# Altium project Quadcopter_controller.PrjPcb
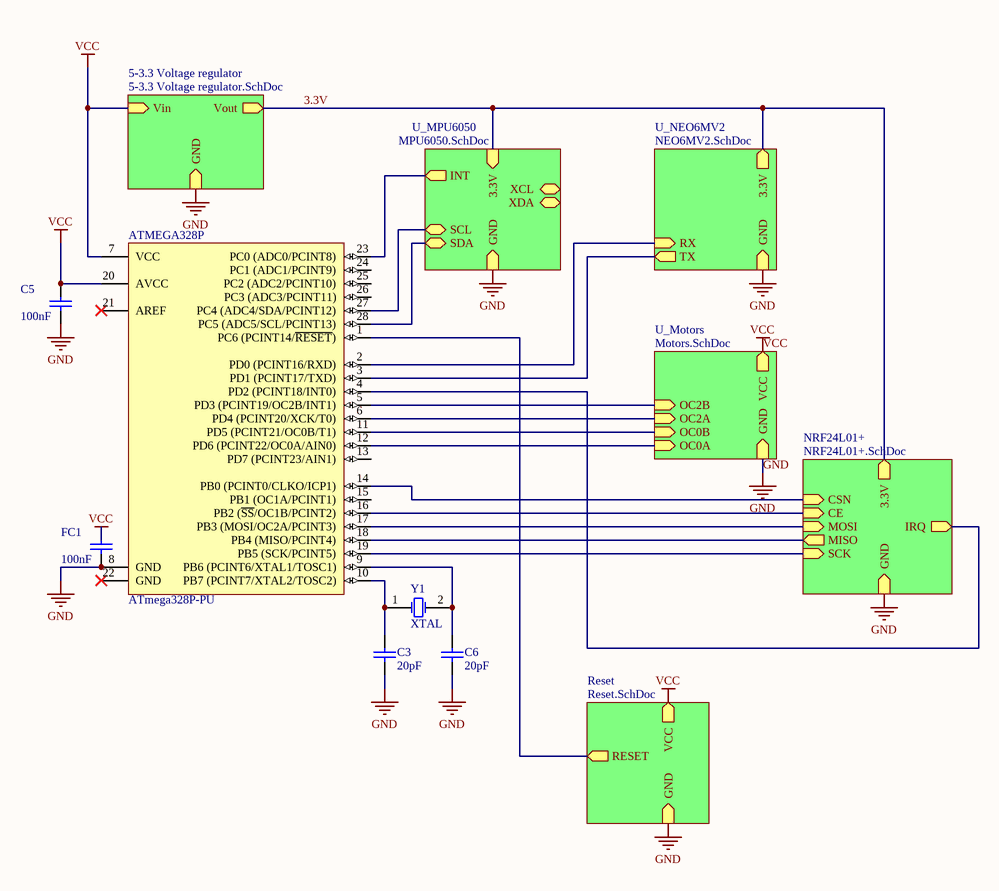
[diagram p0: Quadcopter_controller.SchDoc]
7 sheets, 24 parts. Net scope: hierarchical (ports join the sheet entries above them; power ports are global).
Board file: Quadcopter_controller.PcbDoc
Sheets:
  Quadcopter_controller.SchDoc
    5-3.3 Voltage regulator = 5-3.3 Voltage regulator.SchDoc
    NRF24L01+ = NRF24L01+.SchDoc
    U_Motors = Motors.SchDoc
    U_NEO6MV2 = NEO6MV2.SchDoc
    Reset = Reset.SchDoc
    U_MPU6050 = MPU6050.SchDoc

## Sheet Quadcopter_controller.SchDoc
size A4

### Parts
ATMEGA328P  ATmega328P-PU  [28P3]
C3  20pF  [RAD-0.3]
C5  100nF  [RAD-0.3]
C6  20pF  [RAD-0.3]
FC1  100nF  [RAD-0.3]
Y1  XTAL  [R38]

### Sub-sheets
5-3.3 Voltage regulator = 5-3.3 Voltage regulator.SchDoc: Vin, Vout, GND
NRF24L01+ = NRF24L01+.SchDoc: MOSI (in), SCK (in), 3.3V, CSN (in), CE (in), IRQ (out), MISO (out), GND
Reset = Reset.SchDoc: RESET (out), VCC, GND
U_Motors = Motors.SchDoc: OC0A (in), OC0B (in), OC2A (in), OC2B (in), GND, VCC
U_MPU6050 = MPU6050.SchDoc: 3.3V (in), GND (in), SCL (bidir), SDA (bidir), XDA (bidir), XCL (bidir), INT (out)
U_NEO6MV2 = NEO6MV2.SchDoc: GND, 3.3V, RX (in), TX (out)

### Nets
GND: ATMEGA328P.8(GND) C3.1 C5.1 C6.1 FC1.1 ; sheet 5-3.3 Voltage regulator/GND, sheet NRF24L01+/GND, sheet U_Motors/GND, sheet U_NEO6MV2/GND, sheet Reset/GND, sheet U_MPU6050/GND
VCC: ATMEGA328P.7(VCC) ATMEGA328P.20(AVCC) C5.2 FC1.2 ; sheet 5-3.3 Voltage regulator/Vin, sheet U_Motors/VCC, sheet Reset/VCC
3.3V: sheet 5-3.3 Voltage regulator/Vout, sheet NRF24L01+/3.3V, sheet U_NEO6MV2/3.3V, sheet U_MPU6050/3.3V
NetATMEGA328P_1: ATMEGA328P.1(PC6_(PCINT14/~{RESET})) ; sheet Reset/RESET
NetATMEGA328P_2: ATMEGA328P.2(PD0_(PCINT16/RXD)) ; sheet U_NEO6MV2/RX
NetATMEGA328P_3: ATMEGA328P.3(PD1_(PCINT17/TXD)) ; sheet U_NEO6MV2/TX
NetATMEGA328P_4: ATMEGA328P.4(PD2_(PCINT18/INT0)) ; sheet NRF24L01+/IRQ
NetATMEGA328P_5: ATMEGA328P.5(PD3_(PCINT19/OC2B/INT1)) ; sheet U_Motors/OC2B
NetATMEGA328P_6: ATMEGA328P.6(PD4_(PCINT20/XCK/T0)) ; sheet U_Motors/OC2A
NetATMEGA328P_9: ATMEGA328P.9(PB6_(PCINT6/XTAL1/TOSC1)) C6.2 Y1.2(OSC2)
NetATMEGA328P_10: ATMEGA328P.10(PB7_(PCINT7/XTAL2/TOSC2)) C3.2 Y1.1(OSC1)
NetATMEGA328P_11: ATMEGA328P.11(PD5_(PCINT21/OC0B/T1)) ; sheet U_Motors/OC0B
NetATMEGA328P_12: ATMEGA328P.12(PD6_(PCINT22/OC0A/AIN0)) ; sheet U_Motors/OC0A
NetATMEGA328P_14: ATMEGA328P.14(PB0_(PCINT0/CLKO/ICP1)) ; sheet NRF24L01+/CSN
NetATMEGA328P_16: ATMEGA328P.16(PB2_(~{SS}/OC1B/PCINT2)) ; sheet NRF24L01+/CE
NetATMEGA328P_17: ATMEGA328P.17(PB3_(MOSI/OC2A/PCINT3)) ; sheet NRF24L01+/MOSI
NetATMEGA328P_18: ATMEGA328P.18(PB4_(MISO/PCINT4)) ; sheet NRF24L01+/MISO
NetATMEGA328P_19: ATMEGA328P.19(PB5_(SCK/PCINT5)) ; sheet NRF24L01+/SCK
NetATMEGA328P_23: ATMEGA328P.23(PC0_(ADC0/PCINT8)) ; sheet U_MPU6050/INT
NetATMEGA328P_27: ATMEGA328P.27(PC4_(ADC4/SDA/PCINT12)) ; sheet U_MPU6050/SCL
NetATMEGA328P_28: ATMEGA328P.28(PC5_(ADC5/SCL/PCINT13)) ; sheet U_MPU6050/SDA

Not connected (* = marked no-connect by the designer): ATMEGA328P 13(PD7_(PCINT23/AIN1)) 15(PB1_(OC1A/PCINT1)) 21(AREF)* 22(GND)* 24(PC1_(ADC1/PCINT9)) 25(PC2_(ADC2/PCINT10)) 26(PC3_(ADC3/PCINT11))

### Library data of the parts
ATMEGA328P = ATmega328P-PU: 8-bit AVR Microcontroller, 32KB Flash, 1KB EEPROM, 2KB SRAM, 28-pin PDIP, Industrial Grade (-40°C to 85°C); DatasheetVersion: revD, May-2011; PackageVersion: revB, Sep-2001; PackageReference: 28P3; PackageDescription: 28-lead (0.300"/7.62mm Wide) Plastic Dual Inline Package (PDIP); ComponentLink1Description: Manufacturer URL; ComponentLink1URL: http://www.atmel.com/; ComponentLink2Description: ATmega48A/48PA/88A/88PA/168A/168PA/328/328P Datasheet; ComponentLink2URL: http://www.atmel.com/dyn/resources/prod_documents/8271.pdf; ComponentLink3Description: ATmega48A/48PA/88A/88PA/168A/168PA/328/328P Summary; ComponentLink3URL: http://www.atmel.com/dyn/resources/prod_documents/8271S.pdf
C3 C5 C6 FC1 = Cap: Capacitor; Published: 8-Jun-2000; LatestRevisionDate: 17-Jul-2002; LatestRevisionNote: Re-released for DXP Platform.; PackageReference: RAD-0.3; Publisher: Altium Limited; PackageDescription: Radial Cap, Thru-Hole; 2 Leads; 0.3 in Pin Spacing
  C3 C6: Value: 20pF
  C5 FC1: Value: 100nF
Y1 = XTAL: Crystal Oscillator; Published: 8-Jun-2000; LatestRevisionDate: 17-Jul-2002; LatestRevisionNote: Re-released for DXP Platform.; PackageReference: R38; Publisher: Altium Limited; PackageDescription: Crystal, Thru-Hole; 2 Leads; Body 3.1 x 8.2 mm (Dia.xH)

## Sheet 5-3.3 Voltage regulator.SchDoc
size A4
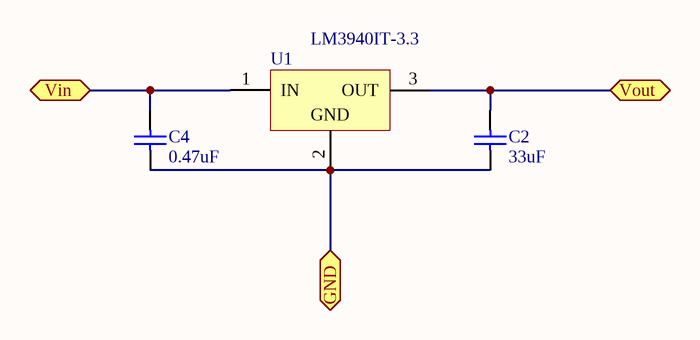
[diagram p1: 5-3.3 Voltage regulator.SchDoc]

### Parts
C2  33uF  [RAD-0.3]
C4  0.47uF  [RAD-0.3]
U1  LM3940IT-3.3  [T03B]

### Ports
GND, Vin, Vout

### Nets
GND: C2.1 C4.1 U1.2(GND) ; port GND
VCC: C4.2 U1.1(IN) ; port Vin
3.3V: C2.2 U1.3(OUT) ; port Vout

### Library data of the parts
C2 C4 = Cap: Capacitor; Published: 8-Jun-2000; LatestRevisionDate: 17-Jul-2002; LatestRevisionNote: Re-released for DXP Platform.; PackageReference: RAD-0.3; Publisher: Altium Limited; PackageDescription: Radial Cap, Thru-Hole; 2 Leads; 0.3 in Pin Spacing
  C2: Value: 33uF
  C4: Value: 0.47uF
U1 = LM3940IT-3.3: 1A Low Dropout Regulator for 5V to 3.3V Conversion, 3-pin TO-220; Manufacturer: National Semiconductor; PackageTopMarking: NSUZXYTTE#*LM3940IT*-3.3 P+; PowerWise: N; CompType: LDO IC; High-Reliability: Y; DatasheetVersion: Jul-2007; PackageVersion: revL, Jan-1992; PackageReference: T03B; PackageDescription: TO-220, Molded, 3 Lead, Straight; PartNumber: LM3940IT-3.3; RoHS: N; PinCount: 3; ComponentLink1Description: Manufacturer URL; ComponentLink1URL: http://www.national.com/; ComponentLink2Description: LM3940 Datasheet; ComponentLink2URL: http://www.national.com/ds/LM/LM3940.pdf; ComponentLink3Description: LM3940 Web Page; ComponentLink3URL: http://www.national.com/pf/LM/LM3940.html; ComponentLink4Description: T03B Package Page; ComponentLink4URL: http://www.national.com/packaging/folders/t03b.html

## Sheet NRF24L01+.SchDoc
size A4
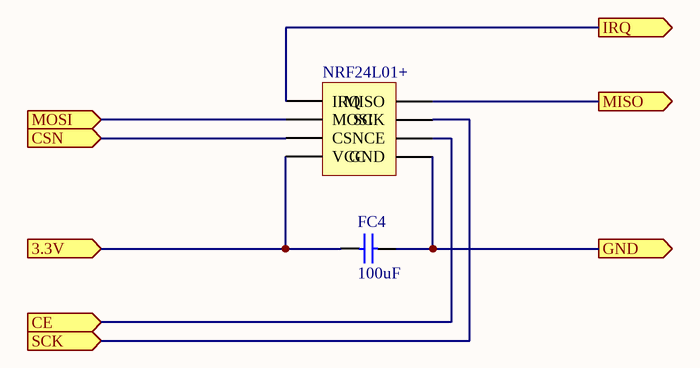
[diagram p2: NRF24L01+.SchDoc]

### Parts
FC4  100uF  [RAD-0.3]
NRF24L01+  nRF24L01+  [HDR2X4]  (value not drawn)

### Ports
3.3V (in), CE (in), CSN (in), GND (out), IRQ (out), MISO (out), MOSI (in), SCK (in)

### Nets
GND: FC4.2 NRF24L01+.1(GND) ; port GND
3.3V: FC4.1 NRF24L01+.2(VCC) ; port 3.3V
NetATMEGA328P_4: NRF24L01+.8(IRQ) ; port IRQ
NetATMEGA328P_14: NRF24L01+.4(CSN) ; port CSN
NetATMEGA328P_16: NRF24L01+.3(CE) ; port CE
NetATMEGA328P_17: NRF24L01+.6(MOSI) ; port MOSI
NetATMEGA328P_18: NRF24L01+.7(MISO) ; port MISO
NetATMEGA328P_19: NRF24L01+.5(SCK) ; port SCK

### Library data of the parts
FC4 = Cap: Capacitor; Published: 8-Jun-2000; LatestRevisionDate: 17-Jul-2002; LatestRevisionNote: Re-released for DXP Platform.; PackageReference: RAD-0.3; Publisher: Altium Limited; PackageDescription: Radial Cap, Thru-Hole; 2 Leads; 0.3 in Pin Spacing; Value: 100uF
NRF24L01+ = Header 4X2: Header, 4-Pin, Dual row; LatestRevisionDate: 17-Jul-2002; LatestRevisionNote: Re-released for DXP Platform.; Publisher: Altium Limited

## Sheet Motors.SchDoc
size A4
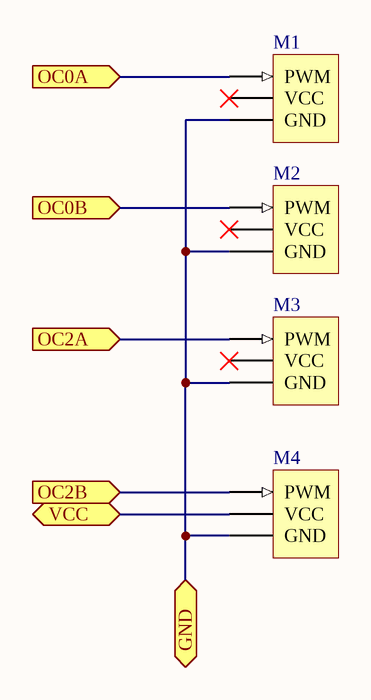
[diagram p3: Motors.SchDoc]

### Parts
M1  Header 3  [HDR1X3]  (value not drawn)
M2  Header 3  [HDR1X3]  (value not drawn)
M3  Header 3  [HDR1X3]  (value not drawn)
M4  Header 3  [HDR1X3]  (value not drawn)

### Ports
GND, OC0A (in), OC0B (in), OC2A (in), OC2B (in), VCC

### Nets
GND: M1.3(GND) M2.3(GND) M3.3(GND) M4.3(GND) ; port GND
VCC: M4.2(VCC) ; port VCC
NetATMEGA328P_5: M4.1(PWM) ; port OC2B
NetATMEGA328P_6: M3.1(PWM) ; port OC2A
NetATMEGA328P_11: M2.1(PWM) ; port OC0B
NetATMEGA328P_12: M1.1(PWM) ; port OC0A

Not connected (* = marked no-connect by the designer): M1 2(VCC)*; M2 2(VCC)*; M3 2(VCC)*

### Library data of the parts
M1-M4 = Header 3: Header, 3-Pin; LatestRevisionDate: 17-Jul-2002; LatestRevisionNote: Re-released for DXP Platform.; Publisher: Altium Limited

## Sheet NEO6MV2.SchDoc
size A4
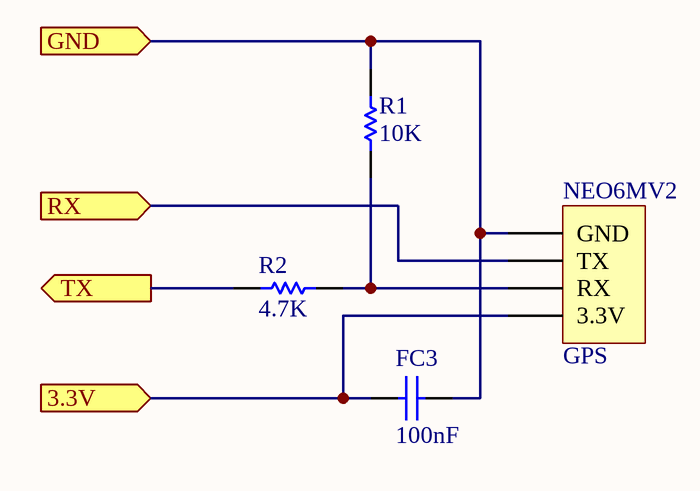
[diagram p4: NEO6MV2.SchDoc]

### Parts
FC3  100nF  [RAD-0.3]
NEO6MV2  GPS  [HDR1X4]
R1  10K  [AXIAL-0.3]
R2  4.7K  [AXIAL-0.3]

### Ports
3.3V (in), GND (in), RX (in), TX (out)

### Nets
GND: FC3.2 NEO6MV2.1(GND) R1.2 ; port GND
3.3V: FC3.1 NEO6MV2.4(3.3V) ; port 3.3V
NetATMEGA328P_2: NEO6MV2.2(TX) ; port RX
NetATMEGA328P_3: R2.1 ; port TX
NetNEO6MV2_3: NEO6MV2.3(RX) R1.1 R2.2

### Library data of the parts
FC3 = Cap: Capacitor; Published: 8-Jun-2000; LatestRevisionDate: 17-Jul-2002; LatestRevisionNote: Re-released for DXP Platform.; PackageReference: RAD-0.3; Publisher: Altium Limited; PackageDescription: Radial Cap, Thru-Hole; 2 Leads; 0.3 in Pin Spacing; Value: 100nF
NEO6MV2 = Header 4: Header, 4-Pin; LatestRevisionDate: 17-Jul-2002; LatestRevisionNote: Re-released for DXP Platform.; Publisher: Altium Limited
R1 R2 = Res1: Resistor; Published: 8-Jun-2000; LatestRevisionDate: 17-Jul-2002; LatestRevisionNote: Re-released for DXP Platform.; PackageReference: AXIAL-0.3; Publisher: Altium Limited; PackageDescription: Axial Device, Thru-Hole; 2 Leads; 0.3 in Pin Spacing
  R1: Value: 10K
  R2: Value: 4.7K

## Sheet Reset.SchDoc
size A4
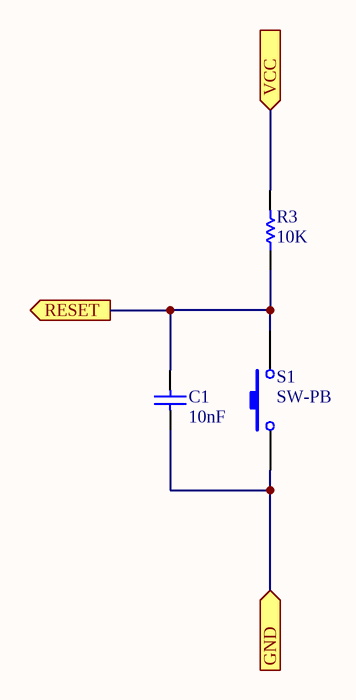
[diagram p5: Reset.SchDoc]

### Parts
C1  10nF  [RAD-0.3]
R3  10K  [AXIAL-0.3]
S1  SW-PB  [SPST-2]

### Ports
GND (in), RESET (out), VCC (in)

### Nets
GND: C1.1 S1.1 ; port GND
VCC: R3.2 ; port VCC
NetATMEGA328P_1: C1.2 R3.1 S1.2 ; port RESET

### Library data of the parts
C1 = Cap: Capacitor; Published: 8-Jun-2000; LatestRevisionDate: 17-Jul-2002; LatestRevisionNote: Re-released for DXP Platform.; PackageReference: RAD-0.3; Publisher: Altium Limited; PackageDescription: Radial Cap, Thru-Hole; 2 Leads; 0.3 in Pin Spacing; Value: 10nF
R3 = Res1: Resistor; Published: 8-Jun-2000; LatestRevisionDate: 17-Jul-2002; LatestRevisionNote: Re-released for DXP Platform.; PackageReference: AXIAL-0.3; Publisher: Altium Limited; PackageDescription: Axial Device, Thru-Hole; 2 Leads; 0.3 in Pin Spacing; Value: 10K
S1 = SW-PB: Switch; Published: 24-Mar-1999; LatestRevisionDate: 17-Jul-2002; LatestRevisionNote: Re-released for DXP Platform.; PackageReference: SPST-2; Publisher: Altium Limited; PackageDescription: Switch; 2 Leads

## Sheet MPU6050.SchDoc
size A4
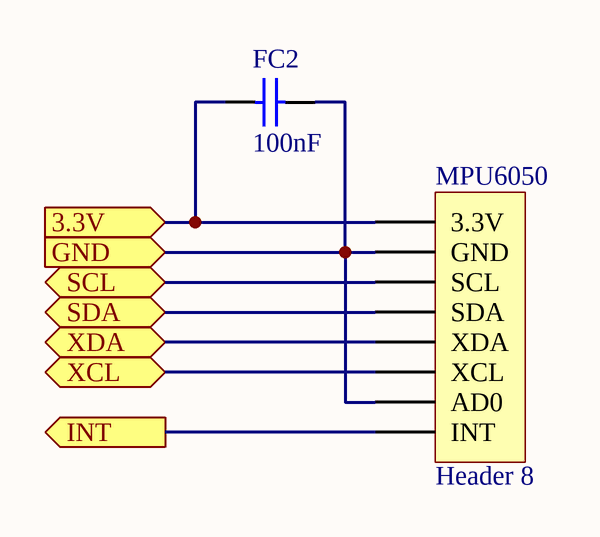
[diagram p6: MPU6050.SchDoc]

### Parts
FC2  100nF  [RAD-0.3]
MPU6050  Header 8  [HDR1X8]

### Ports
3.3V (in), GND (in), INT (out), SCL (bidir), SDA (bidir), XCL (bidir), XDA (bidir)

### Nets
GND: FC2.2 MPU6050.2(GND) MPU6050.7(AD0) ; port GND
3.3V: FC2.1 MPU6050.1(3.3V) ; port 3.3V
NetATMEGA328P_23: MPU6050.8(INT) ; port INT
NetATMEGA328P_27: MPU6050.3(SCL) ; port SCL
NetATMEGA328P_28: MPU6050.4(SDA) ; port SDA
NetMPU6050_5: MPU6050.5(XDA) ; port XDA
NetMPU6050_6: MPU6050.6(XCL) ; port XCL

### Library data of the parts
FC2 = Cap: Capacitor; Published: 8-Jun-2000; LatestRevisionDate: 17-Jul-2002; LatestRevisionNote: Re-released for DXP Platform.; PackageReference: RAD-0.3; Publisher: Altium Limited; PackageDescription: Radial Cap, Thru-Hole; 2 Leads; 0.3 in Pin Spacing; Value: 100nF
MPU6050 = Header 8: Header, 8-Pin; LatestRevisionDate: 17-Jul-2002; LatestRevisionNote: Re-released for DXP Platform.; Publisher: Altium Limited

## Nets that join several sheets
GND: Quadcopter_controller (5 pins), 5-3.3 Voltage regulator (C2.1 C4.1 U1.2), NRF24L01+ (FC4.2 NRF24L01+.1), Motors (M1.3 M2.3 M3.3 M4.3), NEO6MV2 (FC3.2 NEO6MV2.1 R1.2), Reset (C1.1 S1.1), MPU6050 (FC2.2 MPU6050.2 MPU6050.7)
VCC: Quadcopter_controller (ATMEGA328P.7 ATMEGA328P.20 C5.2 FC1.2), 5-3.3 Voltage regulator (C4.2 U1.1), Motors (M4.2), Reset (R3.2)
3.3V: 5-3.3 Voltage regulator (C2.2 U1.3), NRF24L01+ (FC4.1 NRF24L01+.2), NEO6MV2 (FC3.1 NEO6MV2.4), MPU6050 (FC2.1 MPU6050.1)
NetATMEGA328P_1: Quadcopter_controller (ATMEGA328P.1), Reset (C1.2 R3.1 S1.2)
NetATMEGA328P_2: Quadcopter_controller (ATMEGA328P.2), NEO6MV2 (NEO6MV2.2)
NetATMEGA328P_3: Quadcopter_controller (ATMEGA328P.3), NEO6MV2 (R2.1)
NetATMEGA328P_4: Quadcopter_controller (ATMEGA328P.4), NRF24L01+ (NRF24L01+.8)
NetATMEGA328P_5: Quadcopter_controller (ATMEGA328P.5), Motors (M4.1)
NetATMEGA328P_6: Quadcopter_controller (ATMEGA328P.6), Motors (M3.1)
NetATMEGA328P_11: Quadcopter_controller (ATMEGA328P.11), Motors (M2.1)
NetATMEGA328P_12: Quadcopter_controller (ATMEGA328P.12), Motors (M1.1)
NetATMEGA328P_14: Quadcopter_controller (ATMEGA328P.14), NRF24L01+ (NRF24L01+.4)
NetATMEGA328P_16: Quadcopter_controller (ATMEGA328P.16), NRF24L01+ (NRF24L01+.3)
NetATMEGA328P_17: Quadcopter_controller (ATMEGA328P.17), NRF24L01+ (NRF24L01+.6)
NetATMEGA328P_18: Quadcopter_controller (ATMEGA328P.18), NRF24L01+ (NRF24L01+.7)
NetATMEGA328P_19: Quadcopter_controller (ATMEGA328P.19), NRF24L01+ (NRF24L01+.5)
NetATMEGA328P_23: Quadcopter_controller (ATMEGA328P.23), MPU6050 (MPU6050.8)
NetATMEGA328P_27: Quadcopter_controller (ATMEGA328P.27), MPU6050 (MPU6050.3)
NetATMEGA328P_28: Quadcopter_controller (ATMEGA328P.28), MPU6050 (MPU6050.4)